# Altium project ADH_XC7Z010_SoC.PrjPcb (part 2 of 10)

## Sheet Regulators.SchDoc: Regulators
size A3; DrawnBy: Emre Can Damyanlı; Revision: A.1; SheetNumber: 2; SheetTotal: 3; ENG_APP_DATE: --/--/--; DSN_APP_DATE: --/--/--; CHK_APP_DATE: --/--/--
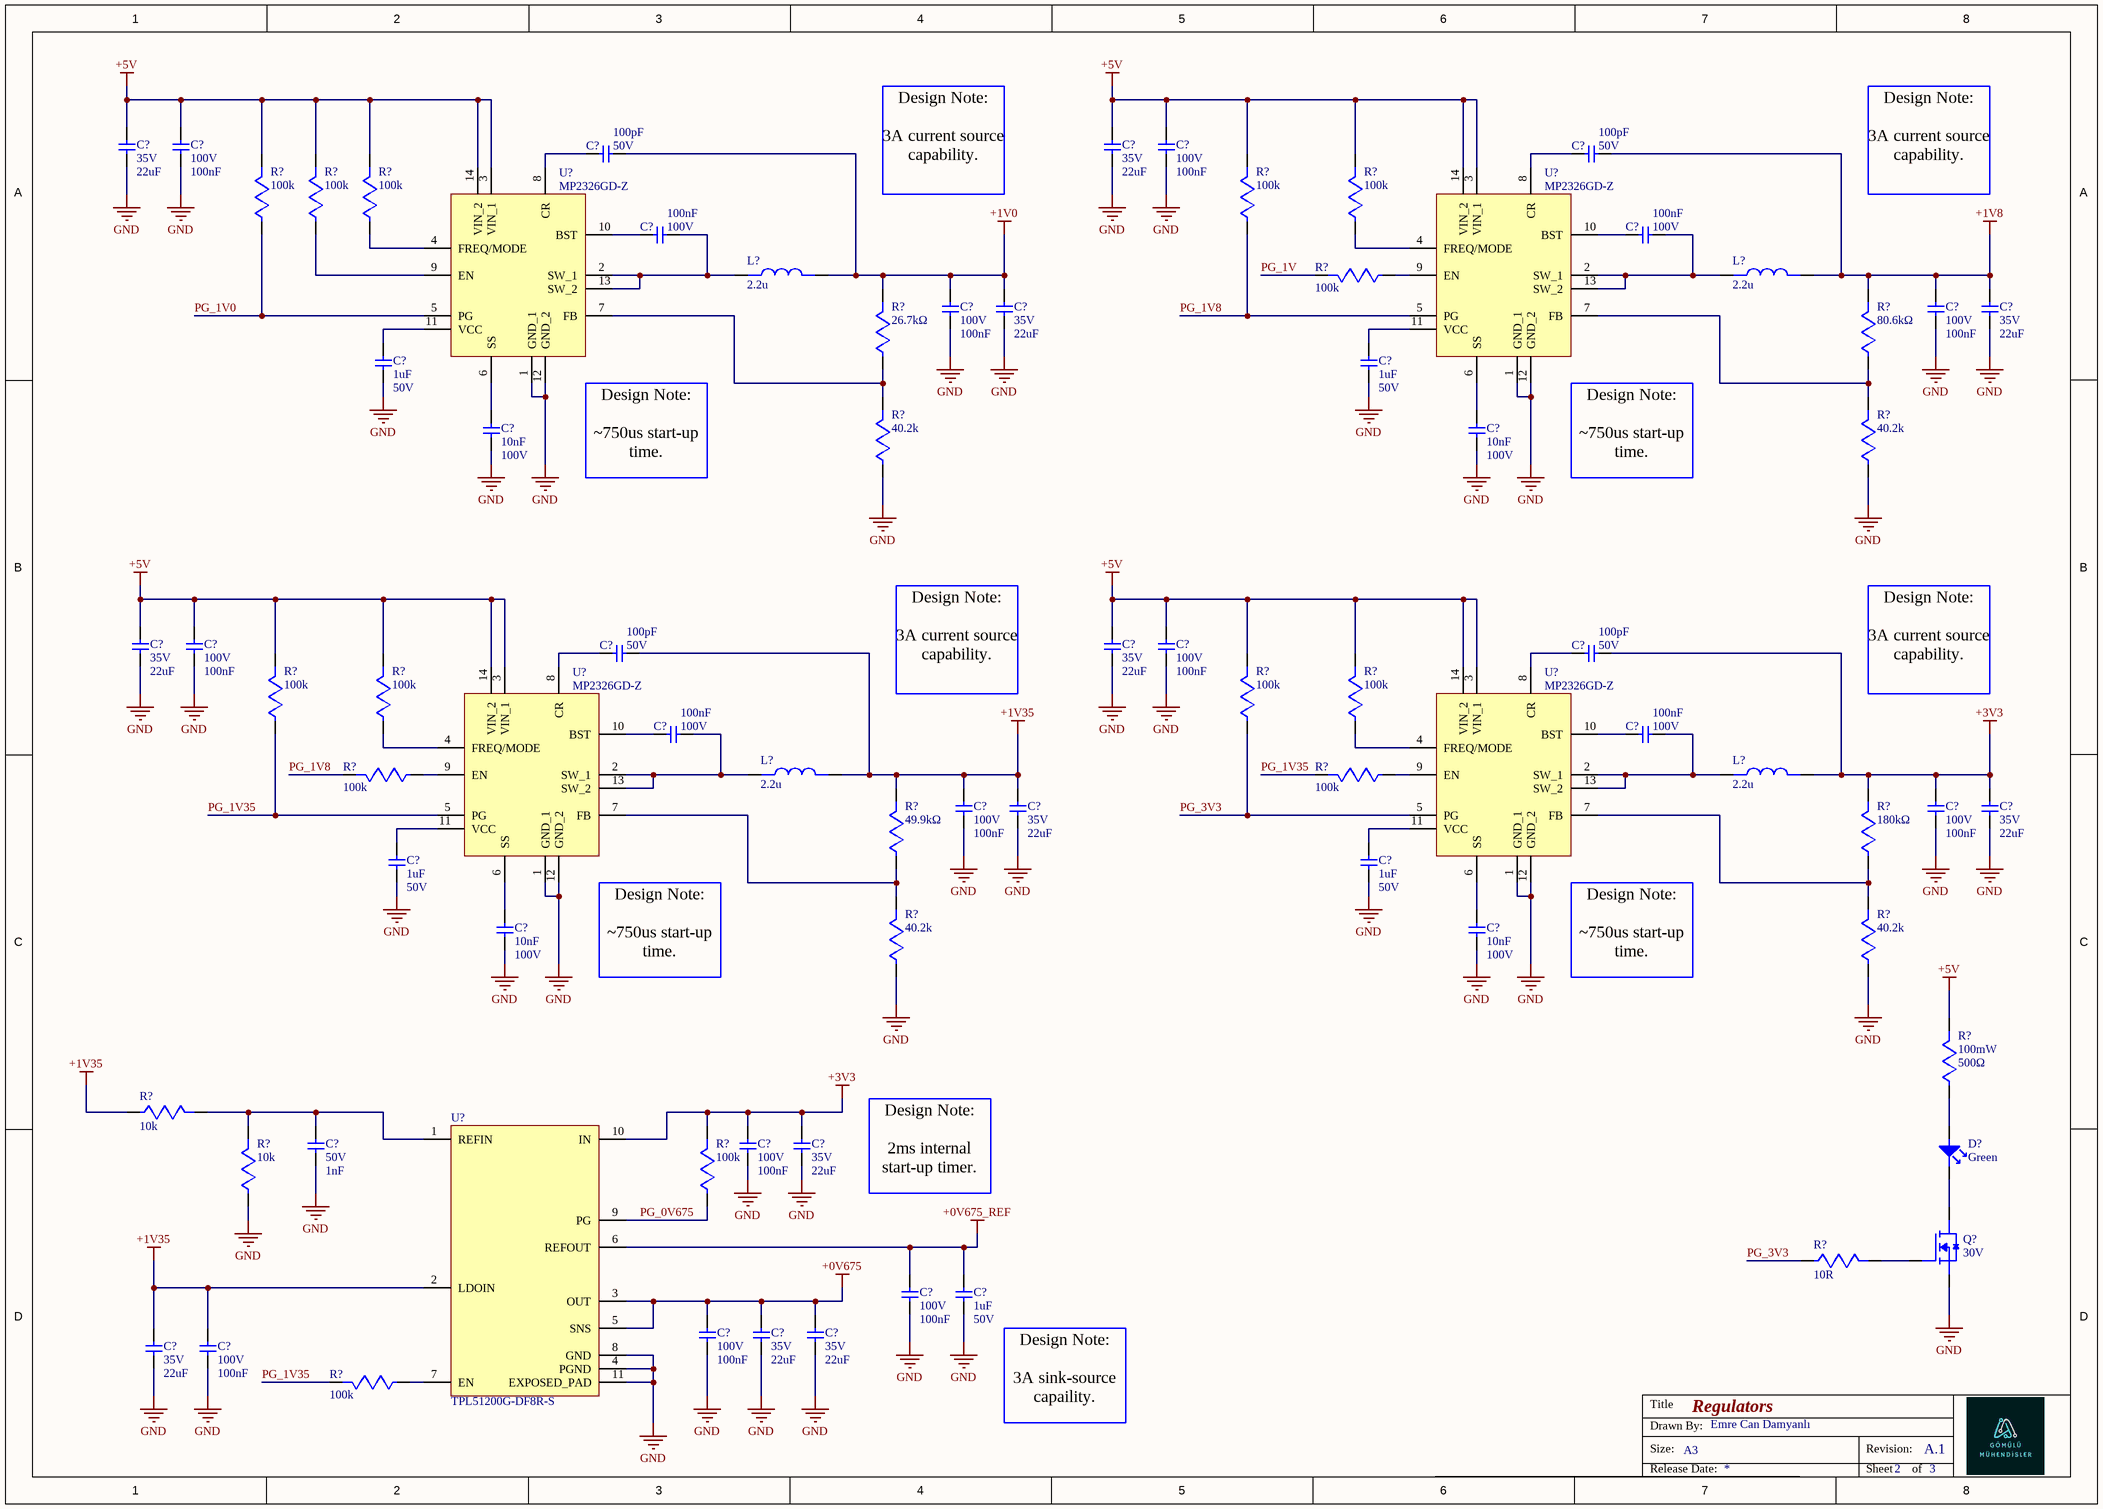
[diagram p1: Regulators.SchDoc]

### Parts
(Parts that share a designator on the sheet are numbered #1, #2 ... from top to bottom, then left to right.)
C?#9  value 22uF  Voltage Rating: 35V  [CAPC2012X145N]  (hidden comment: C2012X5R1V226M125AC)
C?#10  value 100nF  Voltage Rating: 100V  [CAPC1608X94N]  (hidden comment: GCJ188R72A104KA01D)
C?#11  value 22uF  Voltage Rating: 35V  [CAPC2012X145N]  (hidden comment: C2012X5R1V226M125AC)
C?#12  value 100nF  Voltage Rating: 100V  [CAPC1608X94N]  (hidden comment: GCJ188R72A104KA01D)
C?#13  value 100pF  Voltage: 50V  [CAPC1005X55N]  (hidden comment: GRM1555C1H101GA01D)
C?#14  value 100pF  Voltage: 50V  [CAPC1005X55N]  (hidden comment: GRM1555C1H101GA01D)
C?#15  value 100nF  Voltage Rating: 100V  [CAPC1608X94N]  (hidden comment: GCJ188R72A104KA01D)
C?#16  value 100nF  Voltage Rating: 100V  [CAPC1608X94N]  (hidden comment: GCJ188R72A104KA01D)
C?#17  value 100nF  Voltage Rating: 100V  [CAPC1608X94N]  (hidden comment: GCJ188R72A104KA01D)
C?#18  value 22uF  Voltage Rating: 35V  [CAPC2012X145N]  (hidden comment: C2012X5R1V226M125AC)
C?#19  value 100nF  Voltage Rating: 100V  [CAPC1608X94N]  (hidden comment: GCJ188R72A104KA01D)
C?#20  value 22uF  Voltage Rating: 35V  [CAPC2012X145N]  (hidden comment: C2012X5R1V226M125AC)
C?#21  value 1uF  Voltage Rating: 50V  [CAPC1608X94N]  (hidden comment: 06035C105KAT2A)
C?#22  value 1uF  Voltage Rating: 50V  [CAPC1608X94N]  (hidden comment: 06035C105KAT2A)
C?#23  value 10nF  Voltage Rating: 100V  [CAPC1608X94N]  (hidden comment: C0603X103K1RAC3316)
C?#24  value 10nF  Voltage Rating: 100V  [CAPC1608X94N]  (hidden comment: C0603X103K1RAC3316)
C?#25  value 22uF  Voltage Rating: 35V  [CAPC2012X145N]  (hidden comment: C2012X5R1V226M125AC)
C?#26  value 100nF  Voltage Rating: 100V  [CAPC1608X94N]  (hidden comment: GCJ188R72A104KA01D)
C?#27  value 22uF  Voltage Rating: 35V  [CAPC2012X145N]  (hidden comment: C2012X5R1V226M125AC)
C?#28  value 100nF  Voltage Rating: 100V  [CAPC1608X94N]  (hidden comment: GCJ188R72A104KA01D)
C?#29  value 100pF  Voltage: 50V  [CAPC1005X55N]  (hidden comment: GRM1555C1H101GA01D)
C?#30  value 100pF  Voltage: 50V  [CAPC1005X55N]  (hidden comment: GRM1555C1H101GA01D)
C?#31  value 100nF  Voltage Rating: 100V  [CAPC1608X94N]  (hidden comment: GCJ188R72A104KA01D)
C?#32  value 100nF  Voltage Rating: 100V  [CAPC1608X94N]  (hidden comment: GCJ188R72A104KA01D)
C?#33  value 100nF  Voltage Rating: 100V  [CAPC1608X94N]  (hidden comment: GCJ188R72A104KA01D)
C?#34  value 22uF  Voltage Rating: 35V  [CAPC2012X145N]  (hidden comment: C2012X5R1V226M125AC)
C?#35  value 100nF  Voltage Rating: 100V  [CAPC1608X94N]  (hidden comment: GCJ188R72A104KA01D)
C?#36  value 22uF  Voltage Rating: 35V  [CAPC2012X145N]  (hidden comment: C2012X5R1V226M125AC)
C?#37  value 1uF  Voltage Rating: 50V  [CAPC1608X94N]  (hidden comment: 06035C105KAT2A)
C?#38  value 1uF  Voltage Rating: 50V  [CAPC1608X94N]  (hidden comment: 06035C105KAT2A)
C?#39  value 10nF  Voltage Rating: 100V  [CAPC1608X94N]  (hidden comment: C0603X103K1RAC3316)
C?#40  value 10nF  Voltage Rating: 100V  [CAPC1608X94N]  (hidden comment: C0603X103K1RAC3316)
C?#41  value 1nF  Voltage Rating: 50V  [CAPC1608X94N]  (hidden comment: GCJ188R71H102KA01D)
C?#42  value 100nF  Voltage Rating: 100V  [CAPC1608X94N]  (hidden comment: GCJ188R72A104KA01D)
C?#43  value 22uF  Voltage Rating: 35V  [CAPC2012X145N]  (hidden comment: C2012X5R1V226M125AC)
C?#44  value 100nF  Voltage Rating: 100V  [CAPC1608X94N]  (hidden comment: GCJ188R72A104KA01D)
C?#45  value 1uF  Voltage Rating: 50V  [CAPC1608X94N]  (hidden comment: 06035C105KAT2A)
C?#46  value 100nF  Voltage Rating: 100V  [CAPC1608X94N]  (hidden comment: GCJ188R72A104KA01D)
C?#47  value 22uF  Voltage Rating: 35V  [CAPC2012X145N]  (hidden comment: C2012X5R1V226M125AC)
C?#48  value 22uF  Voltage Rating: 35V  [CAPC2012X145N]  (hidden comment: C2012X5R1V226M125AC)
C?#49  value 22uF  Voltage Rating: 35V  [CAPC2012X145N]  (hidden comment: C2012X5R1V226M125AC)
C?#50  value 100nF  Voltage Rating: 100V  [CAPC1608X94N]  (hidden comment: GCJ188R72A104KA01D)
D?#3  Color: Green  [LED_0603_GREEN]  (hidden comment: LTST-C191KGKT)
L?#1  value 2.2u  [WE-LHMI_5020]  (hidden comment: 7443733448022)
L?#2  value 2.2u  [WE-LHMI_5020]  (hidden comment: 7443733448022)
L?#3  value 2.2u  [WE-LHMI_5020]  (hidden comment: 7443733448022)
L?#4  value 2.2u  [WE-LHMI_5020]  (hidden comment: 7443733448022)
Q?#4  Drain to Source Voltage (Vdss): 30V  [CDSOT23]  (hidden comment: DMG3402L-7)
R?#9  value 100k  [RESISTOR_0603]  (hidden comment: RC0603FR-07100KL)
R?#10  value 100k  [RESISTOR_0603]  (hidden comment: RC0603FR-07100KL)
R?#11  value 100k  [RESISTOR_0603]  (hidden comment: RC0603FR-07100KL)
R?#12  value 100k  [RESISTOR_0603]  (hidden comment: RC0603FR-07100KL)
R?#13  value 100k  [RESISTOR_0603]  (hidden comment: RC0603FR-07100KL)
R?#14  value 100k  [RESISTOR_0603]  (hidden comment: RC0603FR-07100KL)
R?#15  value 80.6kΩ  [RESISTOR_0603]  (hidden comment: RC0603FR-0780K6L)
R?#16  value 26.7kΩ  [RESISTOR_0603]  (hidden comment: RC0603FR-0726K7L)
R?#17  value 40.2k  [RESISTOR_0603]  (hidden comment: RC0603FR-0740K2L)
R?#18  value 40.2k  [RESISTOR_0603]  (hidden comment: RC0603FR-0740K2L)
R?#19  value 100k  [RESISTOR_0603]  (hidden comment: RC0603FR-07100KL)
R?#20  value 100k  [RESISTOR_0603]  (hidden comment: RC0603FR-07100KL)
R?#21  value 100k  [RESISTOR_0603]  (hidden comment: RC0603FR-07100KL)
R?#22  value 100k  [RESISTOR_0603]  (hidden comment: RC0603FR-07100KL)
R?#23  value 100k  [RESISTOR_0603]  (hidden comment: RC0603FR-07100KL)
R?#24  value 100k  [RESISTOR_0603]  (hidden comment: RC0603FR-07100KL)
R?#25  value 49.9kΩ  [RESISTOR_0603]  (hidden comment: RC0603FR-0749K9L)
R?#26  value 180kΩ  [RESISTOR_0603]  (hidden comment: RC0603FR-10180KL)
R?#27  value 40.2k  [RESISTOR_0603]  (hidden comment: RC0603FR-0740K2L)
R?#28  value 40.2k  [RESISTOR_0603]  (hidden comment: RC0603FR-0740K2L)
R?#29  value 500Ω  Power Rating: 100mW  [RESISTOR_0603]  (hidden comment: RT0603BRC07500RL)
R?#30  value 10k  [RESISTOR_0603]  (hidden comment: RC0603FR-0710KL)
R?#31  value 100k  [RESISTOR_0603]  (hidden comment: RC0603FR-07100KL)
R?#32  value 10k  [RESISTOR_0603]  (hidden comment: RC0603FR-0710KL)
R?#33  value 10R  [RESISTOR_0603]  (hidden comment: RC0603FR-0710RL)
R?#34  value 100k  [RESISTOR_0603]  (hidden comment: RC0603FR-07100KL)
U?#2  MP2326GD-Z  [MP2326GDP]
U?#3  MP2326GD-Z  [MP2326GDP]
U?#4  MP2326GD-Z  [MP2326GDP]
U?#5  MP2326GD-Z  [MP2326GDP]
U?#6  TPL51200G-DF8R-S  [SON50P300X300X80-11N]

### Nets
+0V675: C?#46.2 C?#47.2 C?#48.2 U?#6.3(OUT) U?#6.5(SNS)
+0V675_REF: C?#44.2 C?#45.2 U?#6.6(REFOUT)
+1V0: C?#13.2 C?#17.2 C?#18.2 L?#1.2 R?#16.2
+1V8: C?#14.2 C?#19.2 C?#20.2 L?#2.2 R?#15.2
+1V35: C?#29.2 C?#33.2 C?#34.2 C?#49.2 C?#50.2 L?#3.2 R?#25.2 R?#30.1 U?#6.2(LDOIN)
+3V3: C?#30.2 C?#35.2 C?#36.2 C?#42.2 C?#43.2 L?#4.2 R?#26.2 R?#31.2 U?#6.10(IN)
+5V: C?#9.2 C?#10.2 C?#11.2 C?#12.2 C?#25.2 C?#26.2 C?#27.2 C?#28.2 R?#9.2 R?#10.2 R?#11.2 R?#12.2 R?#13.2 R?#19.2 R?#20.2 R?#21.2 R?#22.2 R?#29.2 U?#2.3(VIN_1) U?#2.14(VIN_2) U?#3.3(VIN_1) U?#3.14(VIN_2) U?#4.3(VIN_1) U?#4.14(VIN_2) U?#5.3(VIN_1) U?#5.14(VIN_2)
GND: C?#9.1 C?#10.1 C?#11.1 C?#12.1 C?#17.1 C?#18.1 C?#19.1 C?#20.1 C?#21.1 C?#22.1 C?#23.1 C?#24.1 C?#25.1 C?#26.1 C?#27.1 C?#28.1 C?#33.1 C?#34.1 C?#35.1 C?#36.1 C?#37.1 C?#38.1 C?#39.1 C?#40.1 C?#41.1 C?#42.1 C?#43.1 C?#44.1 C?#45.1 C?#46.1 C?#47.1 C?#48.1 C?#49.1 C?#50.1 Q?#4.2(S) R?#17.1 R?#18.1 R?#27.1 R?#28.1 R?#32.1 U?#2.1(GND_1) U?#2.12(GND_2) U?#3.1(GND_1) U?#3.12(GND_2) U?#4.1(GND_1) U?#4.12(GND_2) U?#5.1(GND_1) U?#5.12(GND_2) U?#6.4(PGND) U?#6.8(GND) U?#6.11(EXPOSED_PAD)
PG_0V675: R?#31.1 U?#6.9(PG)
PG_1V: R?#14.2
PG_1V0: R?#9.1 U?#2.5(PG)
PG_1V8: R?#12.1 R?#23.2 U?#3.5(PG)
PG_1V35: R?#19.1 R?#24.2 R?#34.2 U?#4.5(PG)
PG_3V3: R?#21.1 R?#33.1 U?#5.5(PG)
NetC?#13_1: C?#13.1 U?#2.8(CR)
NetC?#14_1: C?#14.1 U?#3.8(CR)
NetC?#15_1: C?#15.1 L?#1.1 U?#2.2(SW_1) U?#2.13(SW_2)
NetC?#15_2: C?#15.2 U?#2.10(BST)
NetC?#16_1: C?#16.1 L?#2.1 U?#3.2(SW_1) U?#3.13(SW_2)
NetC?#16_2: C?#16.2 U?#3.10(BST)
NetC?#21_2: C?#21.2 U?#2.11(VCC)
NetC?#22_2: C?#22.2 U?#3.11(VCC)
NetC?#23_2: C?#23.2 U?#2.6(SS)
NetC?#24_2: C?#24.2 U?#3.6(SS)
NetC?#29_1: C?#29.1 U?#4.8(CR)
NetC?#30_1: C?#30.1 U?#5.8(CR)
NetC?#31_1: C?#31.1 L?#3.1 U?#4.2(SW_1) U?#4.13(SW_2)
NetC?#31_2: C?#31.2 U?#4.10(BST)
NetC?#32_1: C?#32.1 L?#4.1 U?#5.2(SW_1) U?#5.13(SW_2)
NetC?#32_2: C?#32.2 U?#5.10(BST)
NetC?#37_2: C?#37.2 U?#4.11(VCC)
NetC?#38_2: C?#38.2 U?#5.11(VCC)
NetC?#39_2: C?#39.2 U?#4.6(SS)
NetC?#40_2: C?#40.2 U?#5.6(SS)
NetC?#41_2: C?#41.2 R?#30.2 R?#32.2 U?#6.1(REFIN)
NetD?#3_1: D?#3.1 R?#29.1
NetD?#3_2: D?#3.2 Q?#4.3(D)
NetQ?#4_1: Q?#4.1(G) R?#33.2
NetR?#10_1: R?#10.1 U?#2.9(EN)
NetR?#11_1: R?#11.1 U?#2.4(FREQ/MODE)
NetR?#13_1: R?#13.1 U?#3.4(FREQ/MODE)
NetR?#14_1: R?#14.1 U?#3.9(EN)
NetR?#15_1: R?#15.1 R?#18.2 U?#3.7(FB)
NetR?#16_1: R?#16.1 R?#17.2 U?#2.7(FB)
NetR?#20_1: R?#20.1 U?#4.4(FREQ/MODE)
NetR?#22_1: R?#22.1 U?#5.4(FREQ/MODE)
NetR?#23_1: R?#23.1 U?#4.9(EN)
NetR?#24_1: R?#24.1 U?#5.9(EN)
NetR?#25_1: R?#25.1 R?#27.2 U?#4.7(FB)
NetR?#26_1: R?#26.1 R?#28.2 U?#5.7(FB)
NetR?#34_1: R?#34.1 U?#6.7(EN)

### Notes on the sheet
- Design Note:
  3A current source capability.
- (near U?#2) Design Note:
  ~750us start-up time.
- (near U?#3) Design Note:
  ~750us start-up time.
- (near U?#4) Design Note:
  ~750us start-up time.
- (near U?#5) Design Note:
  ~750us start-up time.
- Design Note:
  2ms internal start-up timer.
- (near C?#45) Design Note:
  3A sink-source capaility.
- Title
- Size:
- Drawn By:
- A3
- Revision:
- Release Date:
- Sheet
- of

### Library data of the parts
C?#9 C?#11 C?#18 C?#20 C?#25 C?#27 C?#34 C?#36 C?#43 C?#47-C?#49 = C2012X5R1V226M125AC: Multilayer Ceramic Capacitor, 22 uF, 35 V, ± 20%, X5R, 0805 [2012 Metric]; Manufacturer: TDK; Material: 4241ConductorMaterial; Supplier: Digikey; Supplier Part Number: 445-14428-1-ND; Manufacturer Part Number: C2012X5R1V226M125AC; RoHS: Yes; Category: Ceramic Capacitors; Stock: 157197; Pricing: 1=0,6, 10=0,402, 50=0,3198, 100=0,2641, 500=0,2063, 1000=0,17536 (USD); Mounting Technology: Surface Mount; Case/Package: 0805; Case Code (Metric): 2012; Case Code (Imperial): 0805; Weight: 0.000194oz; Dielectric Material: Ceramic; Min Operating Temperature: -55°C; Max Operating Temperature: 85°C; Package Quantity: 1; Packaging: Tape and Reel; Tolerance: 20%; Dielectric: X5R; Termination: SMD/SMT; Voltage Rating (DC): 35V; Series: C; Length: 0.079inch; Width: 0.049inch; Height: 1.25mm; Thickness: 0.057inch; Reach SVHC Compliant: No; Lead Free: Lead Free; RoHS Compliant: Yes; ComponentLink1URL: https://datasheet.ciiva.com/14893/tdkmlcccaprange-14893110.pdf?src-supplier=Digikey; ComponentLink1Description: https://datasheet.ciiva.com/14893/tdkmlcccaprange-14893110.pdf?src-supplier=Digikey; ComponentLink2URL: https://datasheet.ciiva.com/14893/tdkmlcccaprange-14893109.pdf?src-supplier=Digikey; ComponentLink2Description: https://datasheet.ciiva.com/14893/tdkmlcccaprange-14893109.pdf?src-supplier=Digikey; ComponentLink3URL: https://datasheet.ciiva.com/14893/tdkmlcccaprange-14893111.pdf?src-supplier=Digikey; ComponentLink3Description: https://datasheet.ciiva.com/14893/tdkmlcccaprange-14893111.pdf?src-supplier=Digikey
C?#10 C?#12 C?#15-C?#17 C?#19 C?#26 C?#28 C?#31-C?#33 C?#35 C?#42 C?#44 C?#46 C?#50 = GCJ188R72A104KA01D: Cap Ceramic 0.1uF 100V X7R 10% Pad SMD 0603 Soft Termination 125C Automotive T/R; Manufacturer: Murata; Material: 4241ConductorMaterial; Supplier: Digikey; Supplier Part Number: 490-13420-1-ND; Manufacturer Part Number: GCJ188R72A104KA01D; RoHS: Yes; Category: Ceramic Capacitors; Stock: 681954; Pricing: 1=0,19, 10=0,123, 50=0,0774, 100=0,0619, 500=0,04472, 1000=0,03956 (USD); Mounting Technology: Surface Mount; Case/Package: 0603; Case Code (Metric): 1608; Case Code (Imperial): 0603; Min Operating Temperature: -55°C; Max Operating Temperature: 125°C; Packaging: Cut Tape; Tolerance: 10%; Features: Soft Termination; Series: GCJ; Length: 0.063inch; Width: 0.031inch; Height: 900um; Thickness: 0.035inch; Ratings: AEC-Q200; RoHS Compliant: Yes; Lead Free: 5697LeadFree; ComponentLink1URL: https://datasheet.octopart.com/GCJ188R72A104KA01D-Murata-datasheet-78375067.pdf?src-supplier=Future+Electronics; ComponentLink1Description: https://datasheet.octopart.com/GCJ188R72A104KA01D-Murata-datasheet-78375067.pdf?src-supplier=Future+Electronics; ComponentLink2URL: http://search.murata.co.jp/Ceramy/image/img/A01X/partnumbering_e_02.pdf?src-supplier=Digikey; ComponentLink2Description: http://search.murata.co.jp/Ceramy/image/img/A01X/partnumbering_e_02.pdf?src-supplier=Digikey; ComponentLink3URL: https://www.murata.com/~/media/webrenewal/support/library/catalog/products/capacitor/mlcc/c03e.ashx?la=en-us&src-supplier=Digikey; ComponentLink3Description: https://www.murata.com/~/media/webrenewal/support/library/catalog/products/capacitor/mlcc/c03e.ashx?la=en-us&src-supplier=Digikey; ComponentLink4URL: https://datasheet.octopart.com/GCJ188R72A104KA01D-Murata-datasheet-165611796.pdf?src-supplier=TME; ComponentLink4Description: https://datasheet.octopart.com/GCJ188R72A104KA01D-Murata-datasheet-165611796.pdf?src-supplier=TME
C?#13 C?#14 C?#29 C?#30 = GRM1555C1H101GA01D: 0402 100 pF 50V ±2% Tolerance C0G SMT Multilayer Ceramic Capacitor; Manufacturer: Murata; Manufacturer Lifecycle Status: NRND; Temperature Coefficient: 30ppm/°C; Supplier: Arrow Electronics; Supplier Part Number: GRM1555C1H101GA01D; Manufacturer Part Number: GRM1555C1H101GA01D; RoHS: Compliant; Category: Ceramic Capacitors; Stock: 110000; Pricing: 10000=0,005, 50000=0,005, 100000=0,005 (USD); Case/Package: 0402; Case Code (Imperial): 0402; Case Code (Metric): 1005; Depth: 500µm; Dielectric: C0G; Dielectric Material: Ceramic; Height: 500µm; Lead Free: Lead Free; Length: 1mm; Lifecycle Status: NRND; Material: Ceramic; Max Operating Temperature: 125°C; Min Operating Temperature: -55°C; Mounting Technology: Surface Mount; Number of Terminals: 2; Packaging: Cut Tape; Radiation Hardening: No; REACH SVHC: Yes; Schedule B: 8532240020, 8532240020|8532240020, 8532240020|8532240020|8532240020, 8532240020|8532240020|8532240020|8532240020; Termination: SMD/SMT; Thickness: 500µm; Tolerance: 2%; Voltage Rating: 50V; Voltage Rating (DC): 50V; Width: 500µm; ComponentLink1URL: https://datasheet.octopart.com:443/GRM1555C1H101GA01D-Murata-datasheet-96711518.pdf?src-supplier=element14+APAC; ComponentLink1Description: https://datasheet.octopart.com:443/GRM1555C1H101GA01D-Murata-datasheet-96711518.pdf?src-supplier=element14+APAC; ComponentLink2URL: https://datasheet.octopart.com:443/GRM1555C1H101GA01D-Murata-datasheet-14396360.pdf?src-supplier=Future+Electronics; ComponentLink2Description: https://datasheet.octopart.com:443/GRM1555C1H101GA01D-Murata-datasheet-14396360.pdf?src-supplier=Future+Electronics; ComponentLink3URL: https://datasheet.octopart.com:443/GRM1555C1H101GA01D-Murata-datasheet-22122223.pdf?src-supplier=Future+Electronics; ComponentLink3Description: https://datasheet.octopart.com:443/GRM1555C1H101GA01D-Murata-datasheet-22122223.pdf?src-supplier=Future+Electronics; ComponentLink4URL: https://datasheet.octopart.com:443/GRM1555C1H101GA01D-Murata-datasheet-44105801.pdf?src-supplier=Future+Electronics; ComponentLink4Description: https://datasheet.octopart.com:443/GRM1555C1H101GA01D-Murata-datasheet-44105801.pdf?src-supplier=Future+Electronics; ComponentLink5URL: https://datasheet.octopart.com:443/GRM1555C1H101GA01D-Murata-datasheet-165579666.pdf?src-supplier=TME; ComponentLink5Description: https://datasheet.octopart.com:443/GRM1555C1H101GA01D-Murata-datasheet-165579666.pdf?src-supplier=TME; ComponentLink6URL: https://datasheet.octopart.com:443/GRM1555C1H101GA01D-Murata-datasheet-141266224.pdf?src-supplier=Ciiva; ComponentLink6Description: https://datasheet.octopart.com:443/GRM1555C1H101GA01D-Murata-datasheet-141266224.pdf?src-supplier=Ciiva; ComponentLink7URL: https://datasheet.octopart.com:443/GRM1555C1H101GA01D-Murata-datasheet-140680857.pdf?src-supplier=Ciiva; ComponentLink7Description: https://datasheet.octopart.com:443/GRM1555C1H101GA01D-Murata-datasheet-140680857.pdf?src-supplier=Ciiva; ComponentLink8URL: https://datasheet.octopart.com:443/GRM1555C1H101GA01D-Murata-datasheet-138739441.pdf?src-supplier=Ciiva; ComponentLink8Description: https://datasheet.octopart.com:443/GRM1555C1H101GA01D-Murata-datasheet-138739441.pdf?src-supplier=Ciiva; ComponentLink9URL: https://datasheet.octopart.com/GRM1555C1H101GA01D-Murata-datasheet-12515295.pdf; ComponentLink9Description: https://datasheet.octopart.com/GRM1555C1H101GA01D-Murata-datasheet-12515295.pdf; ComponentLink10URL: https://datasheet.octopart.com/GRM1555C1H101GA01D-Murata-datasheet-12510076.pdf; ComponentLink10Description: https://datasheet.octopart.com/GRM1555C1H101GA01D-Murata-datasheet-12510076.pdf; ComponentLink11URL: https://datasheet.octopart.com/GRM1555C1H101GA01D-Murata-datasheet-11978611.pdf; ComponentLink11Description: https://datasheet.octopart.com/GRM1555C1H101GA01D-Murata-datasheet-11978611.pdf; ComponentLink12URL: https://datasheet.octopart.com/GRM1555C1H101GA01D-Murata-datasheet-10025737.pdf; ComponentLink12Description: https://datasheet.octopart.com/GRM1555C1H101GA01D-Murata-datasheet-10025737.pdf; ComponentLink13URL: https://datasheet.octopart.com/GRM1555C1H101GA01D-Murata-datasheet-8819587.pdf; ComponentLink13Description: https://datasheet.octopart.com/GRM1555C1H101GA01D-Murata-datasheet-8819587.pdf; ComponentLink14URL: http://sigma.octopart.com:80/reach_statement/Murata-company-16.pdf?src-supplier=Compliance+Statements; ComponentLink14Description: http://sigma.octopart.com:80/reach_statement/Murata-company-16.pdf?src-supplier=Compliance+Statements
C?#21 C?#22 C?#37 C?#38 C?#45 = 06035C105KAT2A: Multilayer Ceramic Capacitor, 1 uF, 50 V, ± 10%, X7R, 0603 [1608 Metric]; Manufacturer: Kyocera AVX; Material: 4241ConductorMaterial; Dielectric: 1511DielectricType; Supplier: Digikey; Supplier Part Number: 478-10073-1-ND; Manufacturer Part Number: 06035C105KAT2A; RoHS: Yes; Category: Ceramic Capacitors; Stock: 151526; Pricing: 1=0,53, 10=0,353, 50=0,281, 100=0,232, 500=0,18128, 1000=0,15409 (USD); Mounting Technology: Surface Mount; Case/Package: 345Case; Min Operating Temperature: -55°C; Max Operating Temperature: 125°C; Series: -; Packaging: Cut Tape; Tolerance: 10%; Voltage Rating (DC): 50V; Height: 940um; RoHS Compliant: Yes; ComponentLink1URL: http://datasheet.octopart.com/06035C105KAT2A-KYOCERA-AVX-datasheet-156093842.pdf?src-supplier=Newark; ComponentLink1Description: http://datasheet.octopart.com/06035C105KAT2A-KYOCERA-AVX-datasheet-156093842.pdf?src-supplier=Newark; ComponentLink2URL: https://datasheet.octopart.com/06035C105KAT2A-KYOCERA-AVX-datasheet-156093841.pdf?src-supplier=Future+Electronics; ComponentLink2Description: https://datasheet.octopart.com/06035C105KAT2A-KYOCERA-AVX-datasheet-156093841.pdf?src-supplier=Future+Electronics; ComponentLink3URL: http://catalogs.avx.com/SurfaceMount.pdf?src-supplier=Digikey; ComponentLink3Description: http://catalogs.avx.com/SurfaceMount.pdf?src-supplier=Digikey; ComponentLink4URL: http://datasheets.avx.com/X7RDielectric.pdf?src-supplier=Digikey; ComponentLink4Description: http://datasheets.avx.com/X7RDielectric.pdf?src-supplier=Digikey; ComponentLink5URL: http://datasheet.octopart.com/06035C105KAT2A-KYOCERA-AVX-datasheet-156093842.pdf?src-supplier=Mouser; ComponentLink5Description: http://datasheet.octopart.com/06035C105KAT2A-KYOCERA-AVX-datasheet-156093842.pdf?src-supplier=Mouser; ComponentLink6URL: https://datasheet.octopart.com/06035C105KAT2A-KYOCERA-AVX-datasheet-156093842.pdf?src-supplier=TME; ComponentLink6Description: https://datasheet.octopart.com/06035C105KAT2A-KYOCERA-AVX-datasheet-156093842.pdf?src-supplier=TME; ComponentLink7URL: http://datasheet.octopart.com/06035C105KAT2A-KYOCERA-AVX-datasheet-156093842.pdf?src-supplier=TTI; ComponentLink7Description: http://datasheet.octopart.com/06035C105KAT2A-KYOCERA-AVX-datasheet-156093842.pdf?src-supplier=TTI
C?#23 C?#24 C?#39 C?#40 = C0603X103K1RAC3316: Ceramic Capacitor, Multilayer, Ceramic, 100V, 10% +Tol, 10% -Tol, X7R, 15% TC, 0.01uF, Surface Mount, 0603; Manufacturer: KEMET; Supplier 1: Digikey; Manufacturer Part Number: C0603X103K1RAC3316; RoHS: Yes; Category: Ceramic Capacitors; Stock 1: 16514; Pricing 1: 1=0.4, 10=0.266, 50=0.1962, 100=0.1598, 500=0.12612, 1000=0.1065 (USD); RoHS Compliant: Yes; ComponentLink1URL: https://datasheet.ciiva.com:443/pdfs/VipMasterIC/IC/KEME/KEME-S-A0009553685/KEME-S-A0009553685-1.pdf?src-supplier=IHS+Markit; ComponentLink1Description: https://datasheet.ciiva.com:443/pdfs/VipMasterIC/IC/KEME/KEME-S-A0009553685/KEME-S-A0009553685-1.pdf?src-supplier=IHS+Markit; ComponentLink2URL: https://datasheet.octopart.com/C0603X103K1RAC3316-Kemet-datasheet-67621546.pdf?src-supplier=Newark; ComponentLink2Description: https://datasheet.octopart.com/C0603X103K1RAC3316-Kemet-datasheet-67621546.pdf?src-supplier=Newark; ComponentLink3URL: http://www.farnell.com/datasheets/2163236.pdf?src-supplier=Element14; ComponentLink3Description: http://www.farnell.com/datasheets/2163236.pdf?src-supplier=Element14; ComponentLink4URL: https://datasheet.octopart.com/C0603X103K1RAC3316-Kemet-datasheet-67291864.pdf?src-supplier=Farnell; ComponentLink4Description: https://datasheet.octopart.com/C0603X103K1RAC3316-Kemet-datasheet-67291864.pdf?src-supplier=Farnell; ComponentLink5URL: https://datasheet.octopart.com/C0603X103K1RAC3316-KEMET-datasheet-154582864.pdf?src-supplier=TME; ComponentLink5Description: https://datasheet.octopart.com/C0603X103K1RAC3316-KEMET-datasheet-154582864.pdf?src-supplier=TME; Supplier Part Number 1: 399-C0603X103K1RAC3316CT-ND
C?#41 = GCJ188R71H102KA01D: Multilayer Ceramic Capacitor, 1000 pF, 50 V, ± 10%, X7R, 0603 [1608 Metric]; Manufacturer: Murata; Material: 4241ConductorMaterial; Supplier: Digikey; Supplier Part Number: 490-5768-1-ND; Manufacturer Part Number: GCJ188R71H102KA01D; RoHS: Yes; Category: Ceramic Capacitors; Stock: 165908; Pricing: 1=0,17, 10=0,098, 50=0,0686, 100=0,0595, 500=0,04414, 1000=0,03936 (USD); Mounting Technology: Surface Mount; Case/Package: 0603; Case Code (Metric): 1608; Case Code (Imperial): 0603; Min Operating Temperature: -55°C; Max Operating Temperature: 125°C; Package Quantity: 1; Tolerance: 10%; Packaging: Tape and Reel; Dielectric: X7R; Voltage Rating (DC): 50V; Termination: SMD/SMT; Features: Soft Termination; Series: GCJ; Length: 0.063inch; Width: 0.031inch; Thickness: 0.031inch; Ratings: AEC-Q200; RoHS Compliant: Yes; ComponentLink1URL: https://datasheet.ciiva.com/134/product-134545.pdf?src-supplier=Digikey; ComponentLink1Description: https://datasheet.ciiva.com/134/product-134545.pdf?src-supplier=Digikey; ComponentLink2URL: https://datasheet.ciiva.com/134/s0717e-134546.pdf?src-supplier=Digikey; ComponentLink2Description: https://datasheet.ciiva.com/134/s0717e-134546.pdf?src-supplier=Digikey; ComponentLink3URL: https://datasheet.ciiva.com/134/s0717e-134547.pdf?src-supplier=Digikey; ComponentLink3Description: https://datasheet.ciiva.com/134/s0717e-134547.pdf?src-supplier=Digikey
D?#3 = LTST-C191KGKT: LTST-C191KGKT Lite-On LED, green, 18-71mcd, 130, 1.9V-2.4V SMD, 0603 1.6x0.8x0.55mm RoHS; Manufacturer: Vishay Lite-On; Lens Color: Colorless; Luminous Intensity: 35mcd; Viewing Angle: 130°; Lens Style: Flat,Rectangular,Colorless; Forward Voltage: 2V; Dominant Wavelength: 571nm; Test Current: 20mA; Lens Transparency: Clear; Wavelength: 574nm; Number of LEDs: 1; Max Power Dissipation: 75mW; Lens Size: 0.8mm; Supplier: Digi-Key; Supplier Part Number: 160-1446-1-ND; Manufacturer Part Number: LTST-C191KGKT; RoHS: Yes; Stock: 1655174; Pricing: 1=0,25, 10=0,136, 100=0,063, 500=0,05818, 1000=0,04557, 2000=0,0446 (USD); Mounting Technology: Surface Mount; Case/Package: 0603; Pins: 2; Case Code (Metric): 1608; Case Code (Imperial): 0603; Min Operating Temperature: -55°C; Max Operating Temperature: 85°C; Packaging: Tape and Reel; Series: -; Length: 1.6mm; Width: 0.8mm; Height: 0.65mm; RoHS Compliant: Yes; Lead Free: Lead Free; ComponentLink1URL: https://datasheet.ciiva.com/2109/ltst-c191kgkt-2109973.pdf?src-supplier=Digi-Key; ComponentLink1Description: https://datasheet.ciiva.com/2109/ltst-c191kgkt-2109973.pdf?src-supplier=Digi-Key
L?#1-L?#4 = 7443733448022: Power Inductor, 2.2UH, Shielded, 5.5A Rohs Compliant: Yes; Manufacturer: Wurth Elektronik; Supplier: Farnell; Supplier Part Number: 4413357; Manufacturer Part Number: 7443733448022; Category: Fixed Inductors; Stock: 485; Pricing: 5=2,26, 50=2,06, 250=1,87, 500=1,72, 1000=1,57, 2000=1,55 (EUR)
Q?#4 = DMG3402L-7: MOSFET N-CH 30V 4A SOT23; Manufacturer: Diodes; Rds On Max: 52mR; Input Capacitance: 464pF; Rise Time: 1.6ns; Max Power Dissipation: 1.4W; Fall Time: 2ns; Turn-Off Delay Time: 10.3ns; Turn-On Delay Time: 1.9ns; Gate to Source Voltage (Vgs): 12V; Number of Channels: 1; Polarity: N-CHANNEL; Supplier: Digi-Key; Supplier Part Number: DMG3402L-7DICT-ND; Manufacturer Part Number: DMG3402L-7; RoHS: Yes; Category: MOSFETs; Stock: 1011067; Pricing: 1=0,42, 10=0,298, 100=0,1503, 500=0,13316, 1000=0,10363 (USD); Mounting Technology: Surface Mount; Case/Package: SOT-23; Pins: 3; Weight: 0.000282oz; Min Operating Temperature: -55°C; Max Operating Temperature: 150°C; Package Quantity: 3000; Packaging: Tape and Reel; Continuous Drain Current (ID): 4A; Drain to Source Resistance: 52mR; Series: -; RoHS Compliant: Yes; Lead Free: Lead Free; ComponentLink1URL: http://www.mouser.com/ds/2/115/DMG3402L-473526.pdf?src-supplier=Mouser; ComponentLink1Description: http://www.mouser.com/ds/2/115/DMG3402L-473526.pdf?src-supplier=Mouser; ComponentLink2URL: http://diodes.com/datasheets/DMG3402L.pdf?src-supplier=Avnet; ComponentLink2Description: http://diodes.com/datasheets/DMG3402L.pdf?src-supplier=Avnet
R?#9-R?#14 R?#19-R?#24 R?#31 R?#34 = RC0603FR-07100KL: SMD Chip Resistor, 100 kOhm, ± 1%, 100 mW, 0603 [1608 Metric], Thick Film, General Purpose; Manufacturer: Yageo; Temperature Coefficient: 100ppm/°C; Voltage Rating (DC): 50V; Power Rating: 100mW; Supplier: Digi-Key; Supplier Part Number: 311-100KHRCT-ND; Manufacturer Part Number: RC0603FR-07100KL; RoHS: Yes; Category: Chip SMD Resistors; Stock: 3229176; Pricing: 1=0,1, 10=0,018, 50=0,0106, 100=0,0088, 500=0,00592, 1000=0,00505 (USD); Case/Package: 0603; Pins: 2; Case Code (Imperial): 0603; Case Code (Metric): 1608; Min Operating Temperature: -55°C; Max Operating Temperature: 155°C; Tolerance: 1%; Resistor Type: Thick Film; Packaging: Tape and Reel; Voltage Rating: 50V; Termination: SMD/SMT; Number of Terminations: 2; Features: Moisture Resistant; Series: RC; Max Power Dissipation: 100mW; Resistance Tolerance: 1%; Construction: Rectangular; Technology: THICK FILM; Length: 1.6mm; Width: 0.8mm; Height: 0.45mm; Depth: 0.8mm; Reach SVHC Compliant: No; Military Standard: Not; RoHS Compliant: Yes
R?#15 = RC0603FR-0780K6L: Res Thick Film 0603 80.6K Ohm 1% 0.1W(1/10W) ±100ppm/C Pad SMD T/R; Manufacturer: Yageo Group; Max Power Dissipation: 100mW; Temperature Coefficient: 100ppm/°C; Voltage Rating: 75V; Voltage Rating (DC): 50V; Supplier: Farnell; Supplier Part Number: 3950830; Manufacturer Part Number: RC0603FR-0780K6L; RoHS: Compliant; Category: Chip SMD Resistors; Stock: 8698; Pricing: 10=0,0077, 100=0,0057, 500=0,0053, 1000=0,0048, 2500=0,0037 (EUR); Case/Package: 0603; Case Code (Imperial): 0603; China RoHS: Non-Compliant; Composition: Thick Film; Contact Plating: Tin; Depth: 800µm; Features: Moisture Resistant; Height: 450µm; Lead Free: Lead Free; Length: 1.6mm; Lifecycle Status: Production; Max Operating Temperature: 155°C; Military Standard: Not; Min Operating Temperature: -55°C; Mounting Technology: Surface Mount; Number of Terminals: 2; Number of Terminations: 2; Power Dissipation: 100mW; Power Rating: 100mW; Radiation Hardening: No; REACH SVHC: Yes; Schedule B: 8533210045, 8533210045|8533210045, 8533210045|8533210045|8533210045, 8533210045|8533210045|8533210045|8533210045; Termination: SMD/SMT; Tolerance: 1%; Width: 800µm; Working Voltage: 75V; ComponentLink1URL: https://datasheet.octopart.com:443/RC0603FR-0780K6L-Yageo-datasheet-175887523.pdf?src-supplier=Newark; ComponentLink1Description: https://datasheet.octopart.com:443/RC0603FR-0780K6L-Yageo-datasheet-175887523.pdf?src-supplier=Newark; ComponentLink2URL: https://datasheet.octopart.com:443/RC0603FR-0780K6L-Yageo-datasheet-103092701.pdf?src-supplier=Upverter; ComponentLink2Description: https://datasheet.octopart.com:443/RC0603FR-0780K6L-Yageo-datasheet-103092701.pdf?src-supplier=Upverter; ComponentLink3URL: https://datasheet.octopart.com:443/RC0603FR-0780K6L-Yageo-datasheet-98239111.pdf?src-supplier=Upverter; ComponentLink3Description: https://datasheet.octopart.com:443/RC0603FR-0780K6L-Yageo-datasheet-98239111.pdf?src-supplier=Upverter; ComponentLink4URL: https://datasheet.octopart.com:443/RC0603FR-0780K6L-Yageo-datasheet-164759695.pdf?src-supplier=Future+Electronics; ComponentLink4Description: https://datasheet.octopart.com:443/RC0603FR-0780K6L-Yageo-datasheet-164759695.pdf?src-supplier=Future+Electronics; ComponentLink5URL: https://datasheet.octopart.com:443/RC0603FR-0780K6L-Yageo-datasheet-137700087.pdf?src-supplier=Future+Electronics; ComponentLink5Description: https://datasheet.octopart.com:443/RC0603FR-0780K6L-Yageo-datasheet-137700087.pdf?src-supplier=Future+Electronics; ComponentLink6URL: https://datasheet.octopart.com:443/RC0603FR-0780K6L-Yageo-datasheet-15599030.pdf?src-supplier=Future+Electronics; ComponentLink6Description: https://datasheet.octopart.com:443/RC0603FR-0780K6L-Yageo-datasheet-15599030.pdf?src-supplier=Future+Electronics; ComponentLink7URL: https://datasheet.octopart.com:443/RC0603FR-0780K6L-Yageo-datasheet-12596169.pdf?src-supplier=Future+Electronics; ComponentLink7Description: https://datasheet.octopart.com:443/RC0603FR-0780K6L-Yageo-datasheet-12596169.pdf?src-supplier=Future+Electronics; ComponentLink8URL: https://datasheet.octopart.com:443/RC0603FR-0780K6L-Yageo-datasheet-8328172.pdf?src-supplier=Future+Electronics; ComponentLink8Description: https://datasheet.octopart.com:443/RC0603FR-0780K6L-Yageo-datasheet-8328172.pdf?src-supplier=Future+Electronics; ComponentLink9URL: https://datasheet.octopart.com:443/RC0603FR-0780K6L-Yageo-datasheet-8324193.pdf?src-supplier=Future+Electronics; ComponentLink9Description: https://datasheet.octopart.com:443/RC0603FR-0780K6L-Yageo-datasheet-8324193.pdf?src-supplier=Future+Electronics; ComponentLink10URL: https://datasheet.octopart.com:443/RC0603FR-0780K6L-Yageo-datasheet-148775077.pdf?src-supplier=TME; ComponentLink10Description: https://datasheet.octopart.com:443/RC0603FR-0780K6L-Yageo-datasheet-148775077.pdf?src-supplier=TME; ComponentLink11URL: https://datasheet.octopart.com/RC0603FR-0780K6L-Yageo-datasheet-73766026.pdf; ComponentLink11Description: https://datasheet.octopart.com/RC0603FR-0780K6L-Yageo-datasheet-73766026.pdf; ComponentLink12URL: https://datasheet.octopart.com:443/RC0603FR-0780K6L-Yageo-datasheet-118562.pdf?src-supplier=DigiKey; ComponentLink12Description: https://datasheet.octopart.com:443/RC0603FR-0780K6L-Yageo-datasheet-118562.pdf?src-supplier=DigiKey; ComponentLink13URL: http://sigma.octopart.com:80/conflict_mineral_statement/Yageo-company-3.pdf?src-supplier=Compliance+Statements; ComponentLink13Description: http://sigma.octopart.com:80/conflict_mineral_statement/Yageo-company-3.pdf?src-supplier=Compliance+Statements; ComponentLink14URL: http://sigma.octopart.com:80/rohs_statement/Yageo-company-2.pdf?src-supplier=Compliance+Statements; ComponentLink14Description: http://sigma.octopart.com:80/rohs_statement/Yageo-company-2.pdf?src-supplier=Compliance+Statements
R?#16 = RC0603FR-0726K7L: Res Thick Film 0603 26.7K Ohm 1% 0.1W(1/10W) ±100ppm/C Pad SMD T/R; Manufacturer: Yageo Group; Max Power Dissipation: 100mW; Temperature Coefficient: 100ppm/°C; Voltage Rating: 75V; Voltage Rating (DC): 50V; Supplier: Farnell; Supplier Part Number: 3495786; Manufacturer Part Number: RC0603FR-0726K7L; RoHS: Compliant; Category: Chip SMD Resistors; Stock: 4887; Pricing: 10=0,0048, 100=0,0046, 500=0,0043, 1000=0,0041, 2500=0,0038 (EUR); Case/Package: 0603; Case Code (Imperial): 0603; China RoHS: Non-Compliant; Composition: Thick Film; Contact Plating: Tin; Depth: 800µm; Features: Moisture Resistant; Height: 450µm; Lead Free: Lead Free; Length: 1.6mm; Lifecycle Status: Production; Max Operating Temperature: 155°C; Military Standard: Not; Min Operating Temperature: -55°C; Mounting Technology: Surface Mount; Number of Terminals: 2; Number of Terminations: 2; Power Dissipation: 100mW; Power Rating: 100mW; REACH SVHC: Yes; Schedule B: 8533210045, 8533210045|8533210045, 8533210045|8533210045|8533210045, 8533210045|8533210045|8533210045|8533210045; Termination: SMD/SMT; Tolerance: 1%; Width: 800µm; Working Voltage: 75V; ComponentLink1URL: https://datasheet.octopart.com:443/RC0603FR-0726K7L-Yageo-datasheet-175887523.pdf?src-supplier=Newark; ComponentLink1Description: https://datasheet.octopart.com:443/RC0603FR-0726K7L-Yageo-datasheet-175887523.pdf?src-supplier=Newark; ComponentLink2URL: https://datasheet.octopart.com:443/RC0603FR-0726K7L-Yageo-datasheet-103092701.pdf?src-supplier=Upverter; ComponentLink2Description: https://datasheet.octopart.com:443/RC0603FR-0726K7L-Yageo-datasheet-103092701.pdf?src-supplier=Upverter; ComponentLink3URL: https://datasheet.octopart.com:443/RC0603FR-0726K7L-Yageo-datasheet-8328172.pdf?src-supplier=_legacy+Avnet; ComponentLink3Description: https://datasheet.octopart.com:443/RC0603FR-0726K7L-Yageo-datasheet-8328172.pdf?src-supplier=_legacy+Avnet; ComponentLink4URL: https://datasheet.octopart.com:443/RC0603FR-0726K7L-Yageo-datasheet-164759695.pdf?src-supplier=Future+Electronics; ComponentLink4Description: https://datasheet.octopart.com:443/RC0603FR-0726K7L-Yageo-datasheet-164759695.pdf?src-supplier=Future+Electronics; ComponentLink5URL: https://datasheet.octopart.com:443/RC0603FR-0726K7L-Yageo-datasheet-137700087.pdf?src-supplier=Future+Electronics; ComponentLink5Description: https://datasheet.octopart.com:443/RC0603FR-0726K7L-Yageo-datasheet-137700087.pdf?src-supplier=Future+Electronics; ComponentLink6URL: https://datasheet.octopart.com:443/RC0603FR-0726K7L-Yageo-datasheet-27584510.pdf?src-supplier=Future+Electronics; ComponentLink6Description: https://datasheet.octopart.com:443/RC0603FR-0726K7L-Yageo-datasheet-27584510.pdf?src-supplier=Future+Electronics; ComponentLink7URL: https://datasheet.octopart.com:443/RC0603FR-0726K7L-Yageo-datasheet-15599030.pdf?src-supplier=Future+Electronics; ComponentLink7Description: https://datasheet.octopart.com:443/RC0603FR-0726K7L-Yageo-datasheet-15599030.pdf?src-supplier=Future+Electronics; ComponentLink8URL: https://datasheet.octopart.com:443/RC0603FR-0726K7L-Yageo-datasheet-12596169.pdf?src-supplier=Future+Electronics; ComponentLink8Description: https://datasheet.octopart.com:443/RC0603FR-0726K7L-Yageo-datasheet-12596169.pdf?src-supplier=Future+Electronics; ComponentLink9URL: https://datasheet.octopart.com:443/RC0603FR-0726K7L-Yageo-datasheet-148775077.pdf?src-supplier=TME; ComponentLink9Description: https://datasheet.octopart.com:443/RC0603FR-0726K7L-Yageo-datasheet-148775077.pdf?src-supplier=TME; ComponentLink10URL: https://datasheet.octopart.com/RC0603FR-0726K7L-Yageo-datasheet-73766026.pdf; ComponentLink10Description: https://datasheet.octopart.com/RC0603FR-0726K7L-Yageo-datasheet-73766026.pdf; ComponentLink11URL: https://datasheet.octopart.com:443/RC0603FR-0726K7L-Yageo-datasheet-118562.pdf?src-supplier=DigiKey; ComponentLink11Description: https://datasheet.octopart.com:443/RC0603FR-0726K7L-Yageo-datasheet-118562.pdf?src-supplier=DigiKey; ComponentLink12URL: http://sigma.octopart.com:80/conflict_mineral_statement/Yageo-company-3.pdf?src-supplier=Compliance+Statements; ComponentLink12Description: http://sigma.octopart.com:80/conflict_mineral_statement/Yageo-company-3.pdf?src-supplier=Compliance+Statements; ComponentLink13URL: http://sigma.octopart.com:80/rohs_statement/Yageo-company-2.pdf?src-supplier=Compliance+Statements; ComponentLink13Description: http://sigma.octopart.com:80/rohs_statement/Yageo-company-2.pdf?src-supplier=Compliance+Statements
R?#17 R?#18 R?#27 R?#28 = RC0603FR-0740K2L: SMD Chip Resistor, 40.2 kOhm, ± 1%, 100 mW, 0603 [1608 Metric], Thick Film, General Purpose; Manufacturer: Yageo; Voltage Rating (DC): 50V; Supplier: Digikey; Supplier Part Number: 311-40.2KHRCT-ND; Manufacturer Part Number: RC0603FR-0740K2L; RoHS: Yes; Category: Chip SMD Resistors; Stock: 188643; Pricing: 1=0,1, 10=0,019, 50=0,0112, 100=0,0093, 500=0,00622, 1000=0,00532 (USD); Lead Free: 5697LeadFree; ComponentLink1URL: https://datasheet.ciiva.com/11809/0900766b80f96399-11809261.pdf?src-supplier=Rs; ComponentLink1Description: https://datasheet.ciiva.com/11809/0900766b80f96399-11809261.pdf?src-supplier=Rs; ComponentLink2URL: https://datasheet.ciiva.com/12555/rc0603-272842-12555385.pdf?src-supplier=Mouser; ComponentLink2Description: https://datasheet.ciiva.com/12555/rc0603-272842-12555385.pdf?src-supplier=Mouser
R?#25 = RC0603FR-0749K9L: Fixed Resistor, Metal Glaze/thick Film, 0.1W, 49900ohm, 75V, 1% +/-Tol, 100ppm/Cel, Surface Mount, 0603; Manufacturer: Yageo; Temperature Coefficient: 100ppm/°C; Additional Feature: LASER TRIMMABLE; Power: 100mW; Rated Temperature: 70°C; Package Height: 0.45mm; Package Length: 1.6mm; Package Width: 0.8mm; Supplier 1: Digikey; Manufacturer Part Number: RC0603FR-0749K9L; RoHS: Yes; Category: Chip SMD Resistors; Stock 1: 1668223; Pricing 1: 1=0.1, 10=0.019, 50=0.0112, 100=0.0093, 500=0.00622, 1000=0.00532 (USD); Mounting Technology: Surface Mount; Pins: 2; Package Shape: Rectangular; Case/Package: 0603; Terminal Finish: Nickel; Min Operating Temperature: -55°C; Max Operating Temperature: 155°C; Tolerance: 1%; Packaging: Tape and Reel; JESD-609 Code: e3; Resistor Type: FIXED RESISTOR; Construction: Chip; Package Style: SMTMeter; Technology: METAL GLAZE/THICK FILM; Termination: Wraparound; Working Voltage: 75V; Reach SVHC Compliant: Yes; RoHS Compliant: Yes; ComponentLink1URL: https://datasheet.ciiva.com:443/pdfs/VipMasterIC/IC/YAGO/YAGO-S-A0008145938/YAGO-S-A0008145938-1.pdf?src-supplier=IHS+Markit; ComponentLink1Description: https://datasheet.ciiva.com:443/pdfs/VipMasterIC/IC/YAGO/YAGO-S-A0008145938/YAGO-S-A0008145938-1.pdf?src-supplier=IHS+Markit; ComponentLink2URL: https://datasheet.ciiva.com/2454/pyu-r-int-thick-7-2454043.pdf?src-supplier=Digikey; ComponentLink2Description: https://datasheet.ciiva.com/2454/pyu-r-int-thick-7-2454043.pdf?src-supplier=Digikey; ComponentLink3URL: https://datasheet.ciiva.com/2454/pyu-r-int-thick-7-2454044.pdf?src-supplier=Digikey; ComponentLink3Description: https://datasheet.ciiva.com/2454/pyu-r-int-thick-7-2454044.pdf?src-supplier=Digikey; ComponentLink4URL: https://datasheet.ciiva.com/2454/pyu-r-int-thick-7-2454042.pdf?src-supplier=Digikey; ComponentLink4Description: https://datasheet.ciiva.com/2454/pyu-r-int-thick-7-2454042.pdf?src-supplier=Digikey; ComponentLink5URL: https://datasheet.ciiva.com/15189/getdatasheetpartid-323805-15189749.pdf?src-supplier=Verical; ComponentLink5Description: https://datasheet.ciiva.com/15189/getdatasheetpartid-323805-15189749.pdf?src-supplier=Verical; Supplier Part Number 1: 311-49.9KHRCT-ND
R?#26 = RC0603FR-10180KL: Fixed Resistor, Metal Glaze/thick Film, 0.1W, 180000ohm, 75V, 1% +/-Tol, 100ppm/Cel, Surface Mount, 0603; Manufacturer: Yageo Group; Power Dissipation: 100mW; Temperature Coefficient: 100ppm/°C; Supplier: Mouser; Supplier Part Number: 603-RC0603FR-10180KL; Manufacturer Part Number: RC0603FR-10180KL; RoHS: Compliant; Category: Chip SMD Resistors; Stock: 14030; Pricing: 1=0,1, 10=0,011, 50=0,011, 100=0,005, 1000=0,004, 10000=0,002 (USD); Case/Package: 0603; China RoHS: Non-Compliant; Composition: Thick Film; Contact Plating: Tin; Height: 450µm; Lifecycle Status: Production; Max Operating Temperature: 155°C; Min Operating Temperature: -55°C; Mounting Technology: Surface Mount; Number of Terminals: 2; Packaging: Tape & Reel; Radiation Hardening: No; REACH SVHC: Yes; Tolerance: 1%; Width: 800µm; Working Voltage: 75V; ComponentLink1URL: https://datasheet.octopart.com:443/RC0603FR-10180KL-Yageo-datasheet-175887523.pdf?src-supplier=Newark; ComponentLink1Description: https://datasheet.octopart.com:443/RC0603FR-10180KL-Yageo-datasheet-175887523.pdf?src-supplier=Newark; ComponentLink2URL: https://datasheet.octopart.com/RC0603FR-10180KL-Yageo-datasheet-73766026.pdf; ComponentLink2Description: https://datasheet.octopart.com/RC0603FR-10180KL-Yageo-datasheet-73766026.pdf; ComponentLink3URL: http://sigma.octopart.com:80/rohs_statement/Yageo-company-2.pdf?src-supplier=Compliance+Statements; ComponentLink3Description: http://sigma.octopart.com:80/rohs_statement/Yageo-company-2.pdf?src-supplier=Compliance+Statements; ComponentLink4URL: http://sigma.octopart.com:80/conflict_mineral_statement/Yageo-company-3.pdf?src-supplier=Compliance+Statements; ComponentLink4Description: http://sigma.octopart.com:80/conflict_mineral_statement/Yageo-company-3.pdf?src-supplier=Compliance+Statements
R?#29 = RT0603BRC07500RL: Fixed Resistor, Thin Film, 0.1W, 500ohm, 75V, 0.1% +/-Tol, 15ppm/Cel, Surface Mount, 0603; Manufacturer: Yageo Group; Temperature Coefficient: 15ppm/°C; Supplier: Farnell; Supplier Part Number: 4152629; Manufacturer Part Number: RT0603BRC07500RL; RoHS: Compliant; Category: Chip SMD Resistors; Stock: 4870; Pricing: 5000=0,12 (EUR); Case/Package: 0603; China RoHS: Non-Compliant; Composition: Thin Film; Height: 450µm; Lifecycle Status: Production; Max Operating Temperature: 155°C; Min Operating Temperature: -55°C; Mounting Technology: Surface Mount; Number of Terminals: 2; Packaging: Tape & Reel; Power Dissipation: 100mW; REACH SVHC: Yes; Tolerance: 0.1%; Voltage Rating: 75V; Width: 800µm; Working Voltage: 75V; ComponentLink1URL: https://datasheet.octopart.com:443/RT0603BRC07500RL-Yageo-datasheet-176402239.pdf?src-supplier=IHS; ComponentLink1Description: https://datasheet.octopart.com:443/RT0603BRC07500RL-Yageo-datasheet-176402239.pdf?src-supplier=IHS; ComponentLink2URL: https://datasheet.octopart.com:443/RT0603BRC07500RL-Yageo-datasheet-141265893.pdf?src-supplier=ODG+(Origin+Data+Global); ComponentLink2Description: https://datasheet.octopart.com:443/RT0603BRC07500RL-Yageo-datasheet-141265893.pdf?src-supplier=ODG+(Origin+Data+Global); ComponentLink3URL: https://datasheet.octopart.com:443/RT0603BRC07500RL-Yageo-datasheet-169971040.pdf?src-supplier=Upverter; ComponentLink3Description: https://datasheet.octopart.com:443/RT0603BRC07500RL-Yageo-datasheet-169971040.pdf?src-supplier=Upverter; ComponentLink4URL: https://datasheet.octopart.com:443/RT0603BRC07500RL-Yageo-datasheet-166250672.pdf?src-supplier=Future+Electronics; ComponentLink4Description: https://datasheet.octopart.com:443/RT0603BRC07500RL-Yageo-datasheet-166250672.pdf?src-supplier=Future+Electronics; ComponentLink5URL: https://datasheet.octopart.com/RT0603BRC07500RL-Yageo-datasheet-86813807.pdf; ComponentLink5Description: https://datasheet.octopart.com/RT0603BRC07500RL-Yageo-datasheet-86813807.pdf; ComponentLink6URL: http://sigma.octopart.com:80/rohs_statement/Yageo-company-2.pdf?src-supplier=Compliance+Statements; ComponentLink6Description: http://sigma.octopart.com:80/rohs_statement/Yageo-company-2.pdf?src-supplier=Compliance+Statements; ComponentLink7URL: http://sigma.octopart.com:80/conflict_mineral_statement/Yageo-company-3.pdf?src-supplier=Compliance+Statements; ComponentLink7Description: http://sigma.octopart.com:80/conflict_mineral_statement/Yageo-company-3.pdf?src-supplier=Compliance+Statements
R?#30 R?#32 = RC0603FR-0710KL: SMD Chip Resistor, 10 kOhm, ± 1%, 100 mW, 0603 [1608 Metric], Thick Film, General Purpose; Manufacturer: Yageo; Voltage Rating (DC): 50V; Temperature Coefficient: 100ppm/°C; Power Rating: 100mW; Voltage Rating: 75V; Supplier: Digi-Key; Supplier Part Number: 311-10.0KHRCT-ND; Manufacturer Part Number: RC0603FR-0710KL; RoHS: Yes; Category: Chip SMD Resistors; Stock: 19409735; Pricing: 1=0,1, 10=0,018, 50=0,0106, 100=0,0088, 500=0,00592, 1000=0,00505 (USD); Case/Package: 0603; Pins: 2; Case Code (Imperial): 0603; Case Code (Metric): 1608; Weight: 7.1E-05oz; Min Operating Temperature: -55°C; Max Operating Temperature: 155°C; Tolerance: 1%; Resistor Type: Thick Film; Packaging: Tape and Reel; Termination: SMD/SMT; Features: Moisture Resistant; Series: RC; Max Power Dissipation: 100mW; Number of Terminations: 2; Resistance Tolerance: 1%; Construction: Rectangular; Length: 1.6mm; Width: 0.8mm; Height: 0.45mm; Depth: 0.8mm; Lead Pitch: 0.3mm; Reach SVHC Compliant: No; Lead Free: 5697LeadFree; Military Standard: Not; RoHS Compliant: Yes; ComponentLink1URL: https://datasheet.ciiva.com/7660/38590-7660789.pdf?src-supplier=Element14; ComponentLink1Description: https://datasheet.ciiva.com/7660/38590-7660789.pdf?src-supplier=Element14; ComponentLink2URL: https://datasheet.ciiva.com/7983/443971-7983596.pdf?src-supplier=Element14; ComponentLink2Description: https://datasheet.ciiva.com/7983/443971-7983596.pdf?src-supplier=Element14; ComponentLink3URL: https://datasheet.ciiva.com/22747/443971-22747519.pdf?src-supplier=Element14; ComponentLink3Description: https://datasheet.ciiva.com/22747/443971-22747519.pdf?src-supplier=Element14; ComponentLink4URL: https://datasheet.ciiva.com/46440/1868787-46440891.pdf?src-supplier=Element14; ComponentLink4Description: https://datasheet.ciiva.com/46440/1868787-46440891.pdf?src-supplier=Element14; ComponentLink5URL: https://datasheet.ciiva.com/7746/1738695-7746239.pdf?src-supplier=Element14; ComponentLink5Description: https://datasheet.ciiva.com/7746/1738695-7746239.pdf?src-supplier=Element14; ComponentLink6URL: https://datasheet.ciiva.com/15189/getdatasheetpartid-409289-15189591.pdf?src-supplier=Verical; ComponentLink6Description: https://datasheet.ciiva.com/15189/getdatasheetpartid-409289-15189591.pdf?src-supplier=Verical
R?#33 = RC0603FR-0710RL: SMD Chip Resistor, 10 Ohm, ± 1%, 100 mW, 0603 [1608 Metric], Thick Film, General Purpose; Manufacturer: Yageo; Voltage Rating (DC): 50V; Temperature Coefficient: 200ppm/°C; Max Power Dissipation: 100mW; Supplier: Digi-Key; Supplier Part Number: 311-10.0HRCT-ND; Manufacturer Part Number: RC0603FR-0710RL; RoHS: Yes; Category: Chip SMD Resistors; Stock: 1593496; Pricing: 1=0,1, 10=0,028, 50=0,018, 100=0,015, 500=0,0104, 1000=0,00901 (USD); Case/Package: 0603; Pins: 2; Case Code (Imperial): 0603; Case Code (Metric): 1608; Contact Plating: Tin,Matte; Min Operating Temperature: -55°C; Max Operating Temperature: 155°C; Packaging: Tape and Reel; Tolerance: 1%; Features: Moisture Resistant; Series: RC; Number of Terminations: 2; Power Rating: 100mW; Voltage Rating: 50V; Termination: SMD/SMT; Resistor Type: Thick Film; Resistance Tolerance: 1%; Construction: Rectangular; Technology: THICK FILM; Voltage Rating (AC): 50V; Length: 1.6mm; Width: 0.8mm; Height: 0.45mm; Depth: 0.8mm; Lead Free: Lead Free; RoHS Compliant: Yes; Reach SVHC Compliant: No; Military Standard: Not; ComponentLink1URL: https://datasheet.ciiva.com/11808/0900766b80f96399-11808140.pdf?src-supplier=Rs; ComponentLink1Description: https://datasheet.ciiva.com/11808/0900766b80f96399-11808140.pdf?src-supplier=Rs; ComponentLink2URL: https://datasheet.ciiva.com/7746/443971-7746245.pdf?src-supplier=Element14; ComponentLink2Description: https://datasheet.ciiva.com/7746/443971-7746245.pdf?src-supplier=Element14; ComponentLink3URL: https://datasheet.ciiva.com/8891/pyu-rc0603-51-rohs-l-4-8891285.pdf?src-supplier=Avnet; ComponentLink3Description: https://datasheet.ciiva.com/8891/pyu-rc0603-51-rohs-l-4-8891285.pdf?src-supplier=Avnet
U?#2-U?#5 = MP2326GD-Z: 4A 19V 40µA IQ High Efficiency Step-Down Converter with PG and External SS; Manufacturer: Monolithic Power Systems; Manufacturer Lifecycle Status: ACTIVE; Max Supply Current: 1µA; Max Switching Frequency: 500kHz; Min Input Voltage: 3.9V; Min Output Voltage: 600mV; Nominal Supply Voltage: 12V; Number of Circuits: 1; Output Type: Adjustable; Switching Frequency: 1.1MHz; Topology: Buck; Supplier: Future Electronics; Supplier Part Number: 2145735; Manufacturer Part Number: MP2326GD-Z; RoHS: Compliant; Category: Voltage Regulators - Switching; Pricing: 5000=1,44 (USD); Case/Package: QFN; Contact Plating: Tin; Height - Seated (Max): 1mm; Length: 3mm; Lifecycle Status: Production; Max Supply Voltage: 19V; Max Operating Temperature: 125°C; Max Output current: 4A; Min Operating Temperature: -40°C; Mounting Technology: Surface Mount; Number of Outputs: 1; Pins: 14; Number of Terminals: 14; Operating Supply Voltage: 12V; Output Voltage: 600mV; REACH SVHC: Yes; Terminal Pitch: 500µm; Width: 2mm; ComponentLink1URL: https://datasheet.octopart.com:443/MP2326GD-Z-Monolithic-Power-Systems-datasheet-180786461.pdf?src-supplier=IHS; ComponentLink1Description: https://datasheet.octopart.com:443/MP2326GD-Z-Monolithic-Power-Systems-datasheet-180786461.pdf?src-supplier=IHS; ComponentLink2URL: https://datasheet.octopart.com:443/MP2326GD-Z-Monolithic-Power-Systems-datasheet-175903472.pdf?src-supplier=ODG+(Origin+Data+Global); ComponentLink2Description: https://datasheet.octopart.com:443/MP2326GD-Z-Monolithic-Power-Systems-datasheet-175903472.pdf?src-supplier=ODG+(Origin+Data+Global); ComponentLink3URL: https://datasheet.octopart.com:443/MP2326GD-Z-Monolithic-Power-Systems-datasheet-92240295.pdf?src-supplier=Augswan; ComponentLink3Description: https://datasheet.octopart.com:443/MP2326GD-Z-Monolithic-Power-Systems-datasheet-92240295.pdf?src-supplier=Augswan
U?#6 = TPL51200G-DF8R-S: Converter, DDR Bus Termination Regulator Voltage Regulator IC 2 Output 10-DFN (3x3); Datasheet: https://static.3peak.com/res/doc/ds/Datasheet_TPL51200.pdf